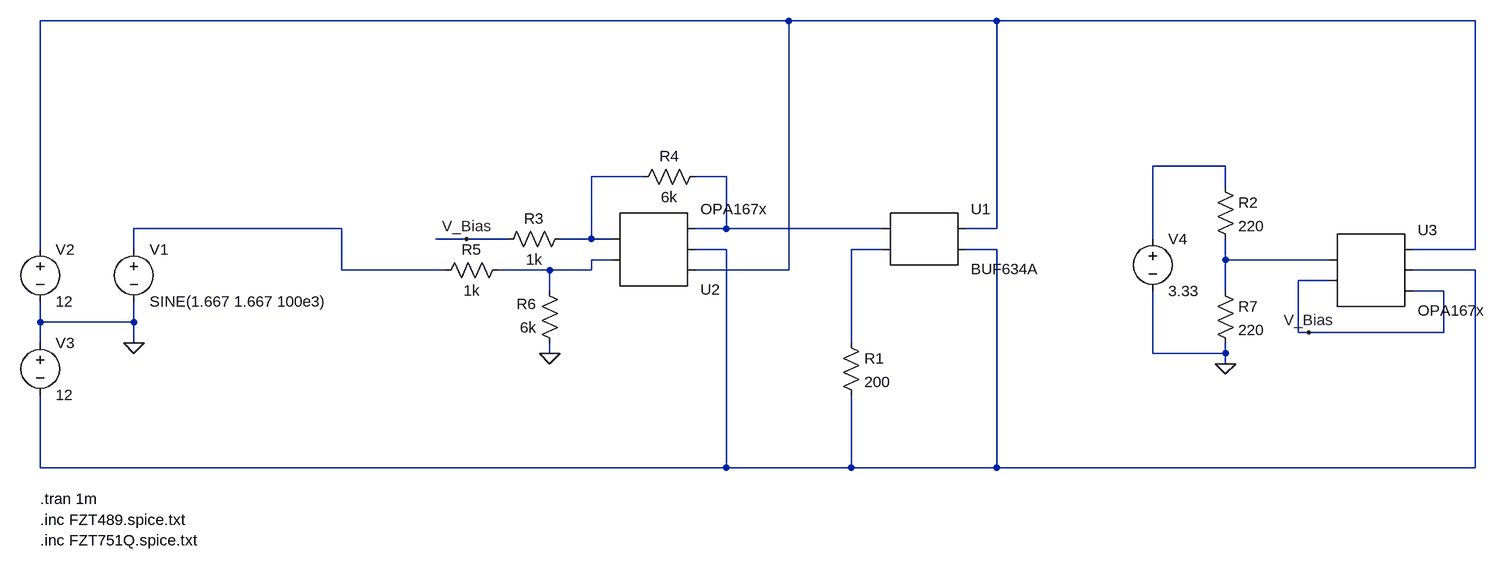
[diagram p0: schematic AnalogOutput.asc]
AnalogOutput.asc, the LTspice schematic file:
Version 4
SHEET 1 2036 948
WIRE 832 -224 -320 -224
WIRE 1152 -224 832 -224
WIRE 1888 -224 1152 -224
WIRE 1504 0 1392 0
WIRE 608 16 528 16
WIRE 736 16 688 16
WIRE 1504 32 1504 0
WIRE 144 96 -176 96
WIRE 736 96 736 16
WIRE 736 96 688 96
WIRE 976 96 736 96
WIRE 1152 96 1152 -224
WIRE 1152 96 1104 96
WIRE 336 112 288 112
WIRE 400 112 336 112
WIRE 528 112 528 16
WIRE 528 112 480 112
WIRE 560 112 528 112
WIRE 1392 112 1392 0
WIRE -320 128 -320 -224
WIRE -176 128 -176 96
WIRE 736 128 688 128
WIRE 976 128 928 128
WIRE 1152 128 1104 128
WIRE 1888 128 1888 -224
WIRE 1888 128 1792 128
WIRE 560 144 528 144
WIRE 1504 144 1504 112
WIRE 1664 144 1504 144
WIRE 144 160 144 96
WIRE 304 160 144 160
WIRE 464 160 384 160
WIRE 528 160 528 144
WIRE 528 160 464 160
WIRE 832 160 832 -224
WIRE 832 160 688 160
WIRE 1888 160 1792 160
WIRE 1664 176 1616 176
WIRE 464 192 464 160
WIRE 1504 192 1504 144
WIRE 1840 192 1792 192
WIRE -320 240 -320 208
WIRE -176 240 -176 208
WIRE -176 240 -320 240
WIRE 1616 256 1616 176
WIRE 1632 256 1616 256
WIRE 1840 256 1840 192
WIRE 1840 256 1632 256
WIRE -320 272 -320 240
WIRE -176 272 -176 240
WIRE 928 272 928 128
WIRE 464 288 464 272
WIRE 1392 288 1392 192
WIRE 1504 288 1504 272
WIRE 1504 288 1392 288
WIRE 1504 304 1504 288
WIRE -320 464 -320 352
WIRE 736 464 736 128
WIRE 736 464 -320 464
WIRE 928 464 928 352
WIRE 928 464 736 464
WIRE 1152 464 1152 128
WIRE 1152 464 928 464
WIRE 1888 464 1888 160
WIRE 1888 464 1152 464
FLAG -176 272 0
FLAG 464 288 0
FLAG 1504 304 0
FLAG 1632 256 V_Bias
FLAG 336 112 V_Bias
SYMBOL voltage -176 112 R0
WINDOW 123 0 0 Left 0
WINDOW 39 0 0 Left 0
SYMATTR InstName V1
SYMATTR Value SINE(1.667 1.667 100e3)
SYMBOL voltage -320 112 R0
WINDOW 123 0 0 Left 0
WINDOW 39 0 0 Left 0
SYMATTR InstName V2
SYMATTR Value 12
SYMBOL voltage -320 256 R0
WINDOW 123 0 0 Left 0
WINDOW 39 0 0 Left 0
SYMATTR InstName V3
SYMATTR Value 12
SYMBOL res 496 96 R90
WINDOW 0 0 56 VBottom 2
WINDOW 3 32 56 VTop 2
SYMATTR InstName R3
SYMATTR Value 1k
SYMBOL res 704 0 R90
WINDOW 0 0 56 VBottom 2
WINDOW 3 32 56 VTop 2
SYMATTR InstName R4
SYMATTR Value 6k
SYMBOL res 400 144 R90
WINDOW 0 0 56 VBottom 2
WINDOW 3 32 56 VTop 2
SYMATTR InstName R5
SYMATTR Value 1k
SYMBOL res 480 288 R180
WINDOW 0 36 76 Left 2
WINDOW 3 36 40 Left 2
SYMATTR InstName R6
SYMATTR Value 6k
SYMBOL AutoGenerated\\OPA167x 624 128 M180
SYMATTR InstName U2
SYMBOL AutoGenerated\\BUF634A 1040 112 R0
SYMATTR InstName U1
SYMBOL res 912 256 R0
SYMATTR InstName R1
SYMATTR Value 200
SYMBOL AutoGenerated\\OPA167x 1728 160 R0
SYMATTR InstName U3
SYMBOL res 1488 16 R0
SYMATTR InstName R2
SYMATTR Value 220
SYMBOL res 1488 176 R0
SYMATTR InstName R7
SYMATTR Value 220
SYMBOL voltage 1392 96 R0
WINDOW 123 0 0 Left 0
WINDOW 39 0 0 Left 0
SYMATTR InstName V4
SYMATTR Value 3.33
TEXT -320 512 Left 2 !.tran 1m
TEXT -320 544 Left 2 !.inc FZT489.spice.txt
TEXT -320 576 Left 2 !.inc FZT751Q.spice.txt

The netlist it stands for:
* AnalogOutput.asc
V1 N005 0 SINE(1.667 1.667 100e3)
V2 N001 0 12
V3 0 N006 12
R3 N003 V_Bias 1k
R4 N004 N003 6k
R5 N008 N005 1k
R6 0 N008 6k
* U2: OPA167x (symbol AutoGenerated\OPA167x not available, pins judged from their places): pin1=N008 pin2=N003 pin3=N001 pin4=N006 pin5=N004
* U1: BUF634A (symbol AutoGenerated\BUF634A not available, pins judged from their places): pin1=N004 pin2=N007 pin3=N001 pin4=N006
R1 N007 N006 200
* U3: OPA167x (symbol AutoGenerated\OPA167x not available, pins judged from their places): pin1=N009 pin2=V_Bias pin3=N001 pin4=N006 pin5=V_Bias
R2 N002 N009 220
R7 N009 0 220
V4 N002 0 3.33
.tran 1m
.inc FZT489.spice.txt
.inc FZT751Q.spice.txt
.backanno
.end